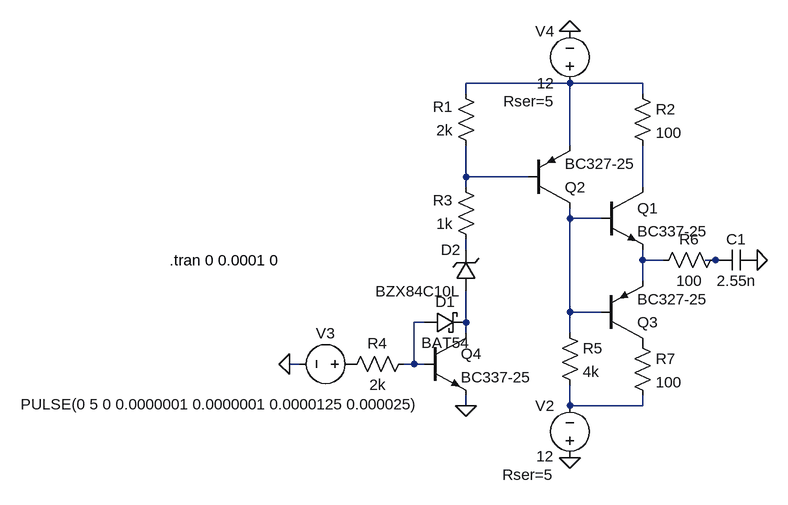
[diagram p0: schematic sender_push_pull_v2.asc]
sender_push_pull_v2.asc, the LTspice schematic file:
Version 4
SHEET 1 1248 692
WIRE 656 64 496 64
WIRE 768 64 656 64
WIRE 496 80 496 64
WIRE 768 80 768 64
WIRE 656 160 656 64
WIRE 496 208 496 160
WIRE 592 208 496 208
WIRE 496 224 496 208
WIRE 768 224 768 160
WIRE 656 272 656 256
WIRE 704 272 656 272
WIRE 496 320 496 304
WIRE 768 336 768 320
WIRE 800 336 768 336
WIRE 880 336 864 336
WIRE 768 368 768 336
WIRE 656 416 656 272
WIRE 704 416 656 416
WIRE 432 432 416 432
WIRE 496 432 496 384
WIRE 496 448 496 432
WIRE 656 448 656 416
WIRE 240 496 224 496
WIRE 416 496 416 432
WIRE 416 496 400 496
WIRE 432 496 416 496
WIRE 496 560 496 544
WIRE 656 560 656 528
WIRE 768 560 768 544
WIRE 768 560 656 560
FLAG 224 496 0
FLAG 656 640 0
FLAG 656 -16 0
FLAG 944 336 0
FLAG 496 560 0
SYMBOL voltage 336 496 R90
WINDOW 0 -32 56 VBottom 2
WINDOW 3 46 215 VTop 2
WINDOW 123 0 0 Left 2
WINDOW 39 0 0 Left 2
SYMATTR InstName V3
SYMATTR Value PULSE(0 5 0 0.0000001 0.0000001 0.0000125 0.000025)
SYMBOL res 416 480 R90
WINDOW 0 0 56 VBottom 2
WINDOW 3 32 56 VTop 2
SYMATTR InstName R4
SYMATTR Value 2k
SYMBOL voltage 656 656 R180
WINDOW 0 24 96 Left 2
WINDOW 3 25 18 Left 2
WINDOW 123 0 0 Left 2
WINDOW 39 25 -10 Left 2
SYMATTR InstName V2
SYMATTR Value 12
SYMATTR SpiceLine Rser=5
SYMBOL res 512 176 R180
WINDOW 0 36 76 Left 2
WINDOW 3 36 40 Left 2
SYMATTR InstName R1
SYMATTR Value 2k
SYMBOL voltage 656 80 R180
WINDOW 0 24 96 Left 2
WINDOW 3 24 16 Left 2
WINDOW 123 0 0 Left 2
WINDOW 39 24 -12 Left 2
SYMATTR InstName V4
SYMATTR Value 12
SYMATTR SpiceLine Rser=5
SYMBOL cap 944 320 R90
WINDOW 0 0 32 VBottom 2
WINDOW 3 32 32 VTop 2
SYMATTR InstName C1
SYMATTR Value 2.55n
SYMBOL npn 704 224 R0
SYMATTR InstName Q1
SYMATTR Value BC337-25
SYMBOL res 752 64 R0
SYMATTR InstName R2
SYMATTR Value 100
SYMBOL npn 432 448 R0
SYMATTR InstName Q4
SYMATTR Value BC337-25
SYMBOL res 640 432 R0
SYMATTR InstName R5
SYMATTR Value 4k
SYMBOL res 752 448 R0
SYMATTR InstName R7
SYMATTR Value 100
SYMBOL pnp 704 464 M180
SYMATTR InstName Q3
SYMATTR Value BC327-25
SYMBOL pnp 592 256 M180
SYMATTR InstName Q2
SYMATTR Value BC327-25
SYMBOL res 512 320 R180
WINDOW 0 36 76 Left 2
WINDOW 3 36 40 Left 2
SYMATTR InstName R3
SYMATTR Value 1k
SYMBOL schottky 432 448 R270
WINDOW 0 32 32 VTop 2
WINDOW 3 0 32 VBottom 2
SYMATTR InstName D1
SYMATTR Value BAT54
SYMATTR Description Diode
SYMATTR Type diode
SYMBOL zener 512 384 R180
WINDOW 0 24 64 Left 2
WINDOW 3 24 0 Left 2
SYMATTR InstName D2
SYMATTR Value BZX84C10L
SYMATTR Description Diode
SYMATTR Type diode
SYMBOL res 896 320 R90
WINDOW 0 0 56 VBottom 2
WINDOW 3 32 56 VTop 2
SYMATTR InstName R6
SYMATTR Value 100
TEXT 40 336 Left 2 !.tran 0 0.0001 0

The netlist it stands for:
* sender_push_pull_v2.asc
V3 P001 0 PULSE(0 5 0 0.0000001 0.0000001 0.0000125 0.000025)
R4 N008 P001 2k
V2 0 N010 12 Rser=5
R1 N002 N001 2k
V4 N001 0 12 Rser=5
C1 0 N007 2.55n
Q1 N003 N004 N006 0 BC337-25
R2 N001 N003 100
Q4 N009 N008 0 0 BC337-25
R5 N004 N010 4k
R7 P002 N010 100
Q3 P002 N004 N006 0 BC327-25
Q2 N004 N002 N001 0 BC327-25
R3 N005 N002 1k
D1 N008 N009 BAT54
D2 N009 N005 BZX84C10L
R6 N007 N006 100
.model D D
.lib standard.dio
.model NPN NPN
.model PNP PNP
.lib standard.bjt
.tran 0 0.0001 0
.backanno
.end